# Vivado block design design_1, xc7z020clg484-1, Vivado 2018.3
# (continued, part 2 of 3)
current_bd_instance /link15

# ---- hierarchy /link16 ----
current_bd_instance /link16
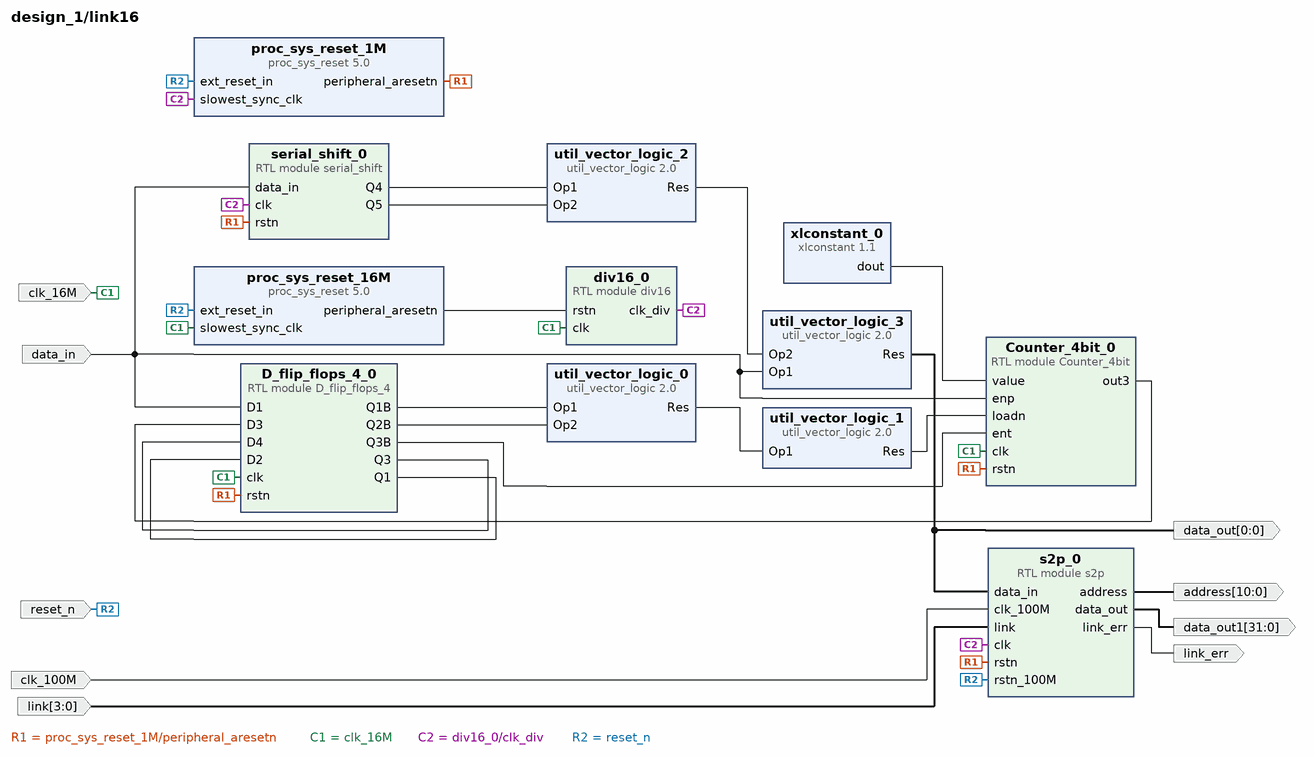
[diagram p14: block diagram inside /link16]
create_bd_pin -dir I clk_100M
create_bd_pin -dir I reset_n
create_bd_pin -dir I data_in
create_bd_pin -dir O -from 0 -to 0 data_out
create_bd_pin -dir I -from 3 -to 0 link
create_bd_pin -dir O link_err
create_bd_pin -dir O -from 10 -to 0 address
create_bd_pin -dir O -from 31 -to 0 data_out1
create_bd_pin -dir I clk_16M

create_bd_cell -type module -reference Counter_4bit Counter_4bit_0
create_bd_cell -type module -reference D_flip_flops_4 D_flip_flops_4_0
create_bd_cell -type module -reference div16 div16_0
create_bd_cell -type module -reference serial_shift serial_shift_0
create_bd_cell -type ip -vlnv xilinx.com:ip:xlconstant:1.1 xlconstant_0
set_property -dict {CONFIG.CONST_VAL 3 CONFIG.CONST_WIDTH 4} [get_bd_cells xlconstant_0]
create_bd_cell -type ip -vlnv xilinx.com:ip:util_vector_logic:2.0 util_vector_logic_0
set_property -dict {CONFIG.C_SIZE 1} [get_bd_cells util_vector_logic_0]
create_bd_cell -type ip -vlnv xilinx.com:ip:util_vector_logic:2.0 util_vector_logic_1
set_property -dict {CONFIG.C_OPERATION not CONFIG.C_SIZE 1} [get_bd_cells util_vector_logic_1]
create_bd_cell -type ip -vlnv xilinx.com:ip:util_vector_logic:2.0 util_vector_logic_2
set_property -dict {CONFIG.C_OPERATION xor CONFIG.C_SIZE 1} [get_bd_cells util_vector_logic_2]
create_bd_cell -type ip -vlnv xilinx.com:ip:util_vector_logic:2.0 util_vector_logic_3
set_property -dict {CONFIG.C_OPERATION xor CONFIG.C_SIZE 1} [get_bd_cells util_vector_logic_3]
create_bd_cell -type ip -vlnv xilinx.com:ip:proc_sys_reset:5.0 proc_sys_reset_16M
create_bd_cell -type ip -vlnv xilinx.com:ip:proc_sys_reset:5.0 proc_sys_reset_1M
create_bd_cell -type module -reference s2p s2p_0

# ---- hierarchy /link17 ----
current_bd_instance /link17
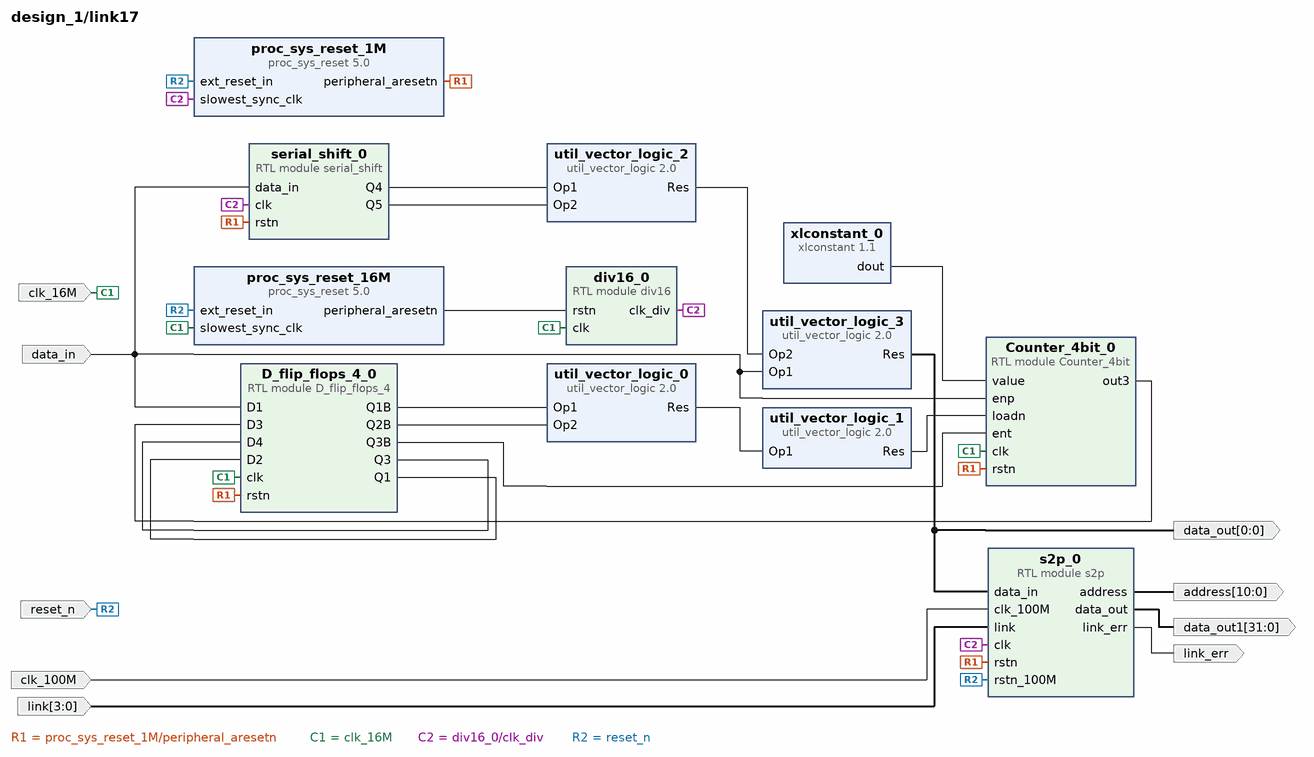
[diagram p15: block diagram inside /link17]
create_bd_pin -dir I clk_100M
create_bd_pin -dir I reset_n
create_bd_pin -dir I data_in
create_bd_pin -dir O -from 0 -to 0 data_out
create_bd_pin -dir I -from 3 -to 0 link
create_bd_pin -dir O link_err
create_bd_pin -dir O -from 10 -to 0 address
create_bd_pin -dir O -from 31 -to 0 data_out1
create_bd_pin -dir I clk_16M

create_bd_cell -type module -reference Counter_4bit Counter_4bit_0
create_bd_cell -type module -reference D_flip_flops_4 D_flip_flops_4_0
create_bd_cell -type module -reference div16 div16_0
create_bd_cell -type module -reference serial_shift serial_shift_0
create_bd_cell -type ip -vlnv xilinx.com:ip:xlconstant:1.1 xlconstant_0
set_property -dict {CONFIG.CONST_VAL 3 CONFIG.CONST_WIDTH 4} [get_bd_cells xlconstant_0]
create_bd_cell -type ip -vlnv xilinx.com:ip:util_vector_logic:2.0 util_vector_logic_0
set_property -dict {CONFIG.C_SIZE 1} [get_bd_cells util_vector_logic_0]
create_bd_cell -type ip -vlnv xilinx.com:ip:util_vector_logic:2.0 util_vector_logic_1
set_property -dict {CONFIG.C_OPERATION not CONFIG.C_SIZE 1} [get_bd_cells util_vector_logic_1]
create_bd_cell -type ip -vlnv xilinx.com:ip:util_vector_logic:2.0 util_vector_logic_2
set_property -dict {CONFIG.C_OPERATION xor CONFIG.C_SIZE 1} [get_bd_cells util_vector_logic_2]
create_bd_cell -type ip -vlnv xilinx.com:ip:util_vector_logic:2.0 util_vector_logic_3
set_property -dict {CONFIG.C_OPERATION xor CONFIG.C_SIZE 1} [get_bd_cells util_vector_logic_3]
create_bd_cell -type ip -vlnv xilinx.com:ip:proc_sys_reset:5.0 proc_sys_reset_16M
create_bd_cell -type ip -vlnv xilinx.com:ip:proc_sys_reset:5.0 proc_sys_reset_1M
create_bd_cell -type module -reference s2p s2p_0

# ---- hierarchy /link18 ----
current_bd_instance /link18
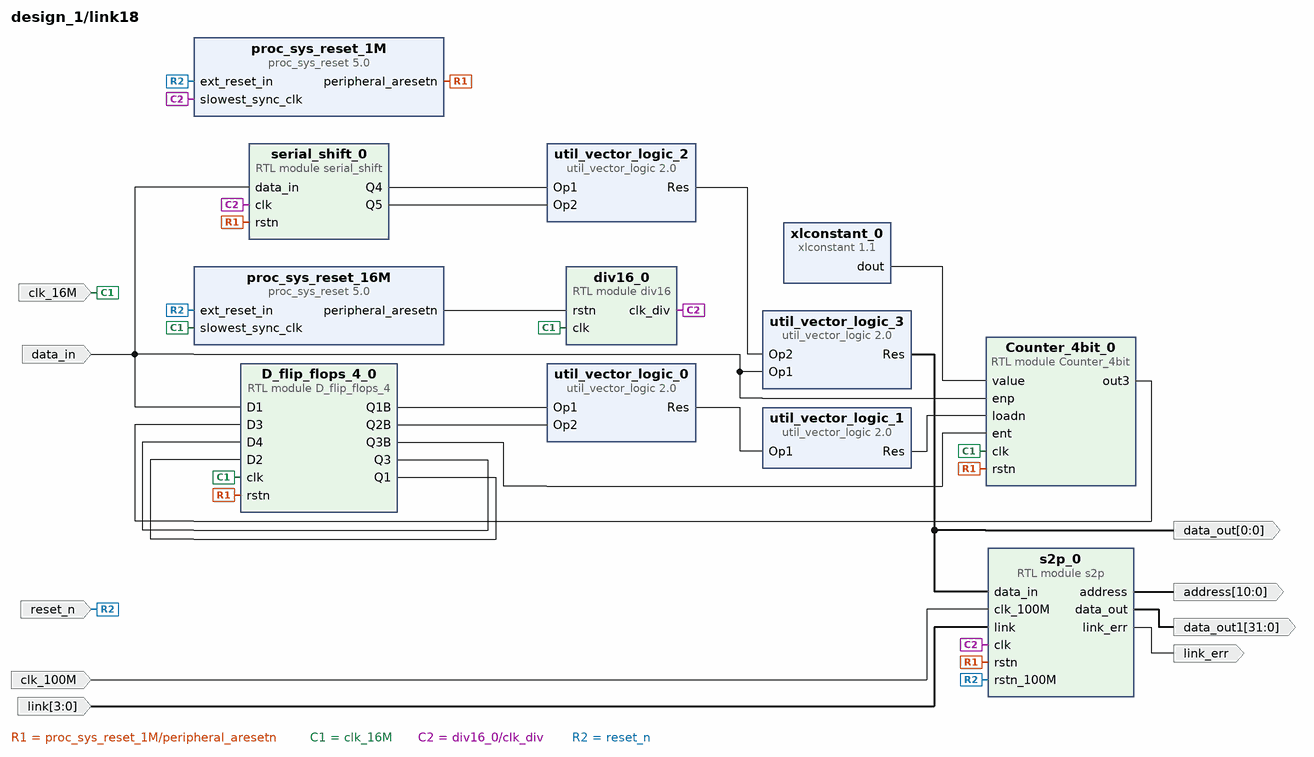
[diagram p16: block diagram inside /link18]
create_bd_pin -dir I clk_100M
create_bd_pin -dir I reset_n
create_bd_pin -dir I data_in
create_bd_pin -dir O -from 0 -to 0 data_out
create_bd_pin -dir I -from 3 -to 0 link
create_bd_pin -dir O link_err
create_bd_pin -dir O -from 10 -to 0 address
create_bd_pin -dir O -from 31 -to 0 data_out1
create_bd_pin -dir I clk_16M

create_bd_cell -type module -reference Counter_4bit Counter_4bit_0
create_bd_cell -type module -reference D_flip_flops_4 D_flip_flops_4_0
create_bd_cell -type module -reference div16 div16_0
create_bd_cell -type module -reference serial_shift serial_shift_0
create_bd_cell -type ip -vlnv xilinx.com:ip:xlconstant:1.1 xlconstant_0
set_property -dict {CONFIG.CONST_VAL 3 CONFIG.CONST_WIDTH 4} [get_bd_cells xlconstant_0]
create_bd_cell -type ip -vlnv xilinx.com:ip:util_vector_logic:2.0 util_vector_logic_0
set_property -dict {CONFIG.C_SIZE 1} [get_bd_cells util_vector_logic_0]
create_bd_cell -type ip -vlnv xilinx.com:ip:util_vector_logic:2.0 util_vector_logic_1
set_property -dict {CONFIG.C_OPERATION not CONFIG.C_SIZE 1} [get_bd_cells util_vector_logic_1]
create_bd_cell -type ip -vlnv xilinx.com:ip:util_vector_logic:2.0 util_vector_logic_2
set_property -dict {CONFIG.C_OPERATION xor CONFIG.C_SIZE 1} [get_bd_cells util_vector_logic_2]
create_bd_cell -type ip -vlnv xilinx.com:ip:util_vector_logic:2.0 util_vector_logic_3
set_property -dict {CONFIG.C_OPERATION xor CONFIG.C_SIZE 1} [get_bd_cells util_vector_logic_3]
create_bd_cell -type ip -vlnv xilinx.com:ip:proc_sys_reset:5.0 proc_sys_reset_16M
create_bd_cell -type ip -vlnv xilinx.com:ip:proc_sys_reset:5.0 proc_sys_reset_1M
create_bd_cell -type module -reference s2p s2p_0

# ---- hierarchy /link19 ----
current_bd_instance /link19
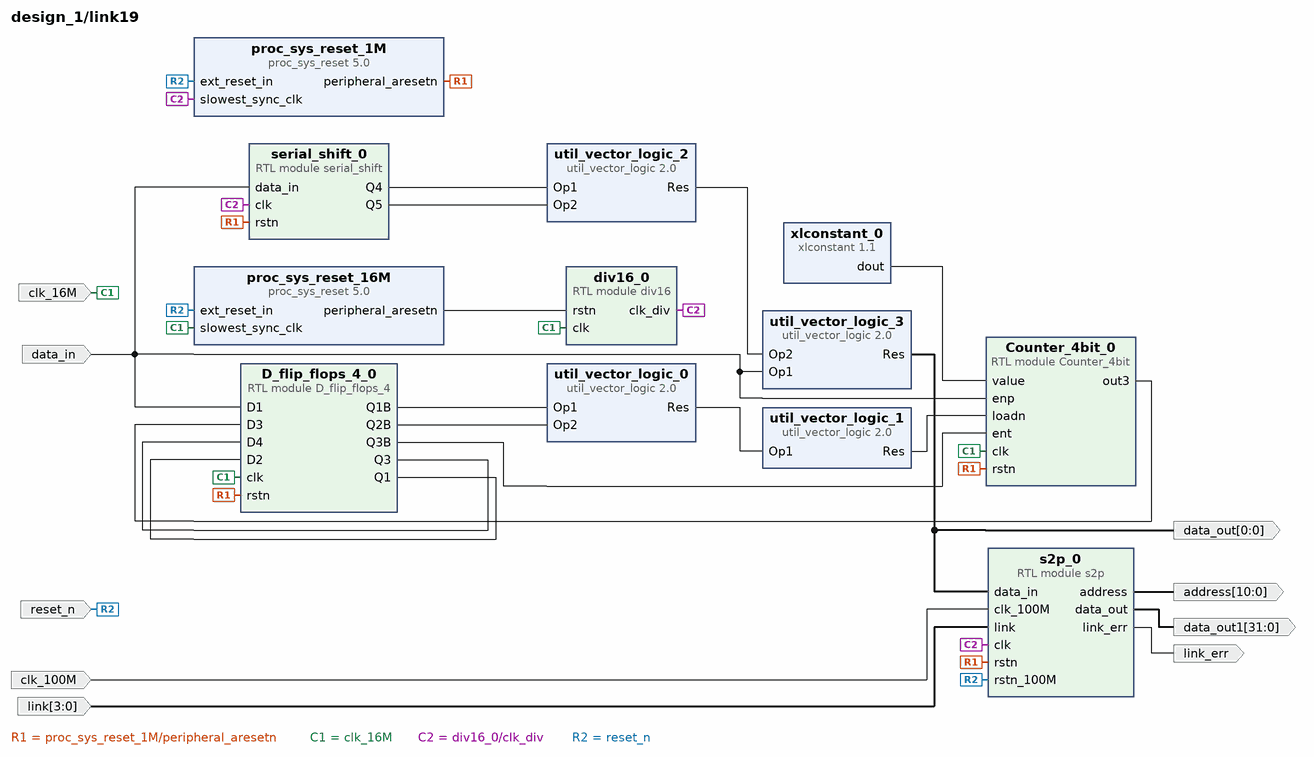
[diagram p17: block diagram inside /link19]
create_bd_pin -dir I clk_100M
create_bd_pin -dir I reset_n
create_bd_pin -dir I data_in
create_bd_pin -dir O -from 0 -to 0 data_out
create_bd_pin -dir I -from 3 -to 0 link
create_bd_pin -dir O link_err
create_bd_pin -dir O -from 10 -to 0 address
create_bd_pin -dir O -from 31 -to 0 data_out1
create_bd_pin -dir I clk_16M

create_bd_cell -type module -reference Counter_4bit Counter_4bit_0
create_bd_cell -type module -reference D_flip_flops_4 D_flip_flops_4_0
create_bd_cell -type module -reference div16 div16_0
create_bd_cell -type module -reference serial_shift serial_shift_0
create_bd_cell -type ip -vlnv xilinx.com:ip:xlconstant:1.1 xlconstant_0
set_property -dict {CONFIG.CONST_VAL 3 CONFIG.CONST_WIDTH 4} [get_bd_cells xlconstant_0]
create_bd_cell -type ip -vlnv xilinx.com:ip:util_vector_logic:2.0 util_vector_logic_0
set_property -dict {CONFIG.C_SIZE 1} [get_bd_cells util_vector_logic_0]
create_bd_cell -type ip -vlnv xilinx.com:ip:util_vector_logic:2.0 util_vector_logic_1
set_property -dict {CONFIG.C_OPERATION not CONFIG.C_SIZE 1} [get_bd_cells util_vector_logic_1]
create_bd_cell -type ip -vlnv xilinx.com:ip:util_vector_logic:2.0 util_vector_logic_2
set_property -dict {CONFIG.C_OPERATION xor CONFIG.C_SIZE 1} [get_bd_cells util_vector_logic_2]
create_bd_cell -type ip -vlnv xilinx.com:ip:util_vector_logic:2.0 util_vector_logic_3
set_property -dict {CONFIG.C_OPERATION xor CONFIG.C_SIZE 1} [get_bd_cells util_vector_logic_3]
create_bd_cell -type ip -vlnv xilinx.com:ip:proc_sys_reset:5.0 proc_sys_reset_16M
create_bd_cell -type ip -vlnv xilinx.com:ip:proc_sys_reset:5.0 proc_sys_reset_1M
create_bd_cell -type module -reference s2p s2p_0

# ---- hierarchy /link20 ----
current_bd_instance /link20
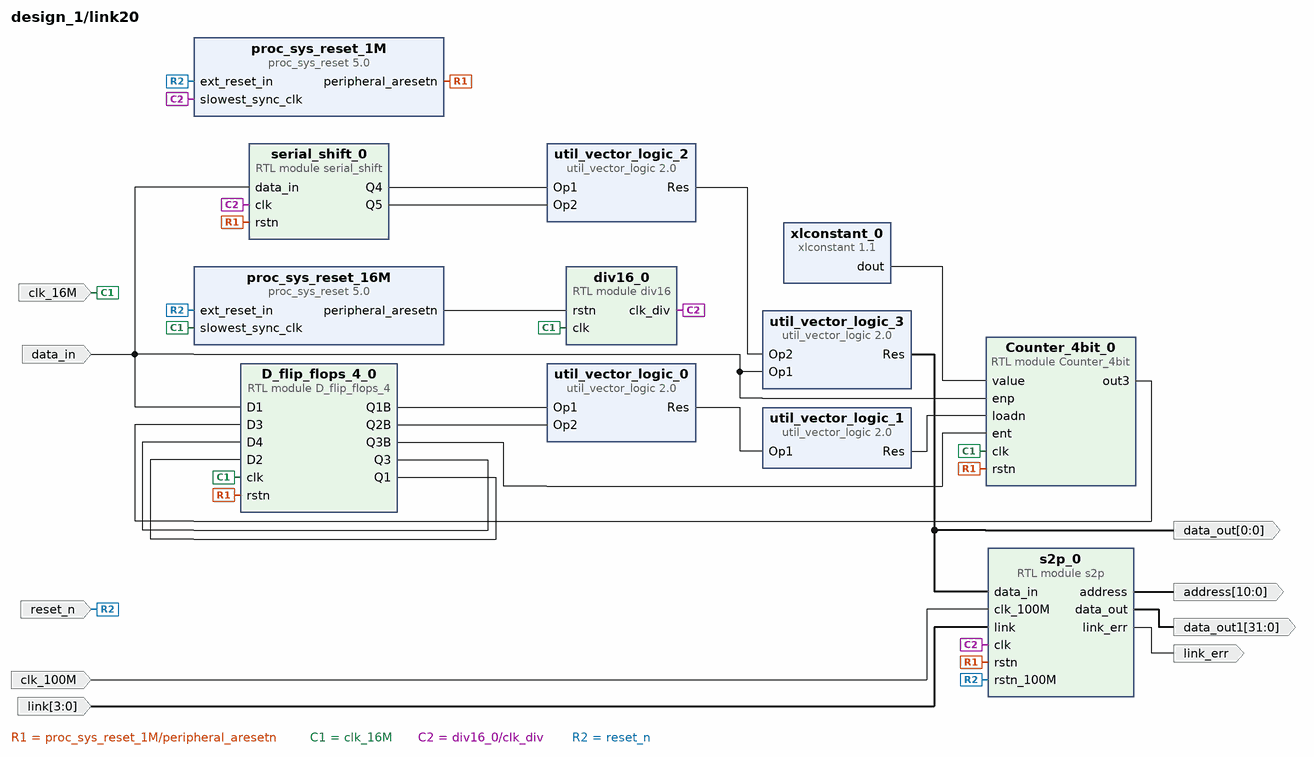
[diagram p18: block diagram inside /link20]
create_bd_pin -dir I clk_100M
create_bd_pin -dir I reset_n
create_bd_pin -dir I data_in
create_bd_pin -dir O -from 0 -to 0 data_out
create_bd_pin -dir I -from 3 -to 0 link
create_bd_pin -dir O link_err
create_bd_pin -dir O -from 10 -to 0 address
create_bd_pin -dir O -from 31 -to 0 data_out1
create_bd_pin -dir I clk_16M

create_bd_cell -type module -reference Counter_4bit Counter_4bit_0
create_bd_cell -type module -reference D_flip_flops_4 D_flip_flops_4_0
create_bd_cell -type module -reference div16 div16_0
create_bd_cell -type module -reference serial_shift serial_shift_0
create_bd_cell -type ip -vlnv xilinx.com:ip:xlconstant:1.1 xlconstant_0
set_property -dict {CONFIG.CONST_VAL 3 CONFIG.CONST_WIDTH 4} [get_bd_cells xlconstant_0]
create_bd_cell -type ip -vlnv xilinx.com:ip:util_vector_logic:2.0 util_vector_logic_0
set_property -dict {CONFIG.C_SIZE 1} [get_bd_cells util_vector_logic_0]
create_bd_cell -type ip -vlnv xilinx.com:ip:util_vector_logic:2.0 util_vector_logic_1
set_property -dict {CONFIG.C_OPERATION not CONFIG.C_SIZE 1} [get_bd_cells util_vector_logic_1]
create_bd_cell -type ip -vlnv xilinx.com:ip:util_vector_logic:2.0 util_vector_logic_2
set_property -dict {CONFIG.C_OPERATION xor CONFIG.C_SIZE 1} [get_bd_cells util_vector_logic_2]
create_bd_cell -type ip -vlnv xilinx.com:ip:util_vector_logic:2.0 util_vector_logic_3
set_property -dict {CONFIG.C_OPERATION xor CONFIG.C_SIZE 1} [get_bd_cells util_vector_logic_3]
create_bd_cell -type ip -vlnv xilinx.com:ip:proc_sys_reset:5.0 proc_sys_reset_16M
create_bd_cell -type ip -vlnv xilinx.com:ip:proc_sys_reset:5.0 proc_sys_reset_1M
create_bd_cell -type module -reference s2p s2p_0

# ---- hierarchy /link21 ----
current_bd_instance /link21
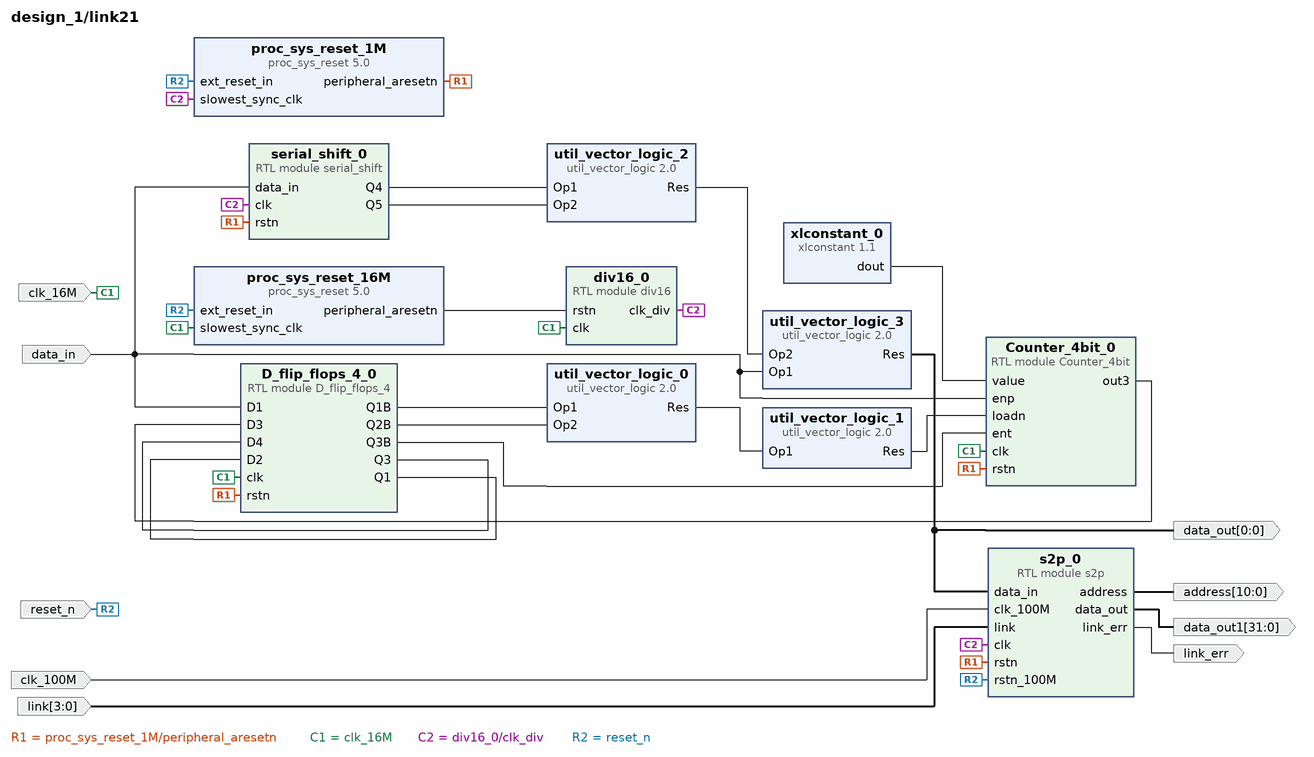
[diagram p19: block diagram inside /link21]
create_bd_pin -dir I clk_100M
create_bd_pin -dir I reset_n
create_bd_pin -dir I data_in
create_bd_pin -dir O -from 0 -to 0 data_out
create_bd_pin -dir I -from 3 -to 0 link
create_bd_pin -dir O link_err
create_bd_pin -dir O -from 10 -to 0 address
create_bd_pin -dir O -from 31 -to 0 data_out1
create_bd_pin -dir I clk_16M

create_bd_cell -type module -reference Counter_4bit Counter_4bit_0
create_bd_cell -type module -reference D_flip_flops_4 D_flip_flops_4_0
create_bd_cell -type module -reference div16 div16_0
create_bd_cell -type module -reference serial_shift serial_shift_0
create_bd_cell -type ip -vlnv xilinx.com:ip:xlconstant:1.1 xlconstant_0
set_property -dict {CONFIG.CONST_VAL 3 CONFIG.CONST_WIDTH 4} [get_bd_cells xlconstant_0]
create_bd_cell -type ip -vlnv xilinx.com:ip:util_vector_logic:2.0 util_vector_logic_0
set_property -dict {CONFIG.C_SIZE 1} [get_bd_cells util_vector_logic_0]
create_bd_cell -type ip -vlnv xilinx.com:ip:util_vector_logic:2.0 util_vector_logic_1
set_property -dict {CONFIG.C_OPERATION not CONFIG.C_SIZE 1} [get_bd_cells util_vector_logic_1]
create_bd_cell -type ip -vlnv xilinx.com:ip:util_vector_logic:2.0 util_vector_logic_2
set_property -dict {CONFIG.C_OPERATION xor CONFIG.C_SIZE 1} [get_bd_cells util_vector_logic_2]
create_bd_cell -type ip -vlnv xilinx.com:ip:util_vector_logic:2.0 util_vector_logic_3
set_property -dict {CONFIG.C_OPERATION xor CONFIG.C_SIZE 1} [get_bd_cells util_vector_logic_3]
create_bd_cell -type ip -vlnv xilinx.com:ip:proc_sys_reset:5.0 proc_sys_reset_16M
create_bd_cell -type ip -vlnv xilinx.com:ip:proc_sys_reset:5.0 proc_sys_reset_1M
create_bd_cell -type module -reference s2p s2p_0

# ---- hierarchy /link22 ----
current_bd_instance /link22
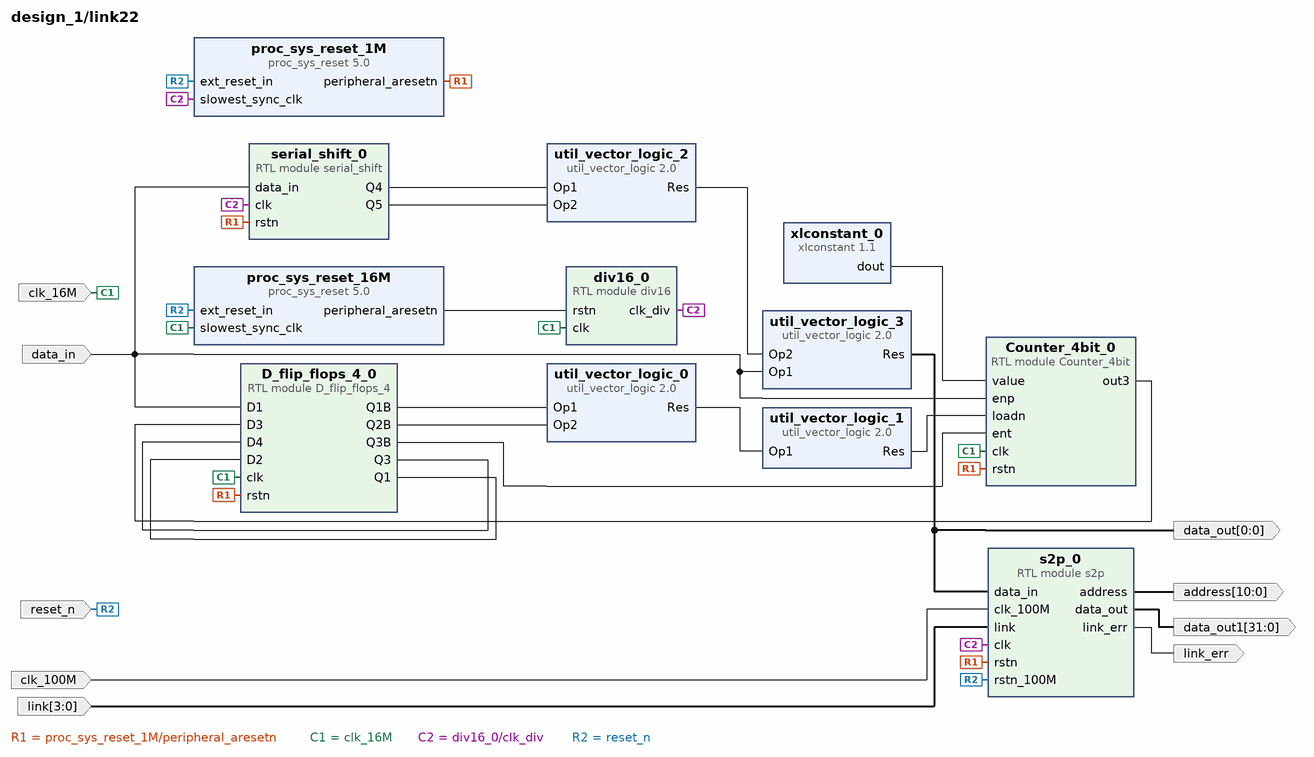
[diagram p20: block diagram inside /link22]
create_bd_pin -dir I clk_100M
create_bd_pin -dir I reset_n
create_bd_pin -dir I data_in
create_bd_pin -dir O -from 0 -to 0 data_out
create_bd_pin -dir I -from 3 -to 0 link
create_bd_pin -dir O link_err
create_bd_pin -dir O -from 10 -to 0 address
create_bd_pin -dir O -from 31 -to 0 data_out1
create_bd_pin -dir I clk_16M

create_bd_cell -type module -reference Counter_4bit Counter_4bit_0
create_bd_cell -type module -reference D_flip_flops_4 D_flip_flops_4_0
create_bd_cell -type module -reference div16 div16_0
create_bd_cell -type module -reference serial_shift serial_shift_0
create_bd_cell -type ip -vlnv xilinx.com:ip:xlconstant:1.1 xlconstant_0
set_property -dict {CONFIG.CONST_VAL 3 CONFIG.CONST_WIDTH 4} [get_bd_cells xlconstant_0]
create_bd_cell -type ip -vlnv xilinx.com:ip:util_vector_logic:2.0 util_vector_logic_0
set_property -dict {CONFIG.C_SIZE 1} [get_bd_cells util_vector_logic_0]
create_bd_cell -type ip -vlnv xilinx.com:ip:util_vector_logic:2.0 util_vector_logic_1
set_property -dict {CONFIG.C_OPERATION not CONFIG.C_SIZE 1} [get_bd_cells util_vector_logic_1]
create_bd_cell -type ip -vlnv xilinx.com:ip:util_vector_logic:2.0 util_vector_logic_2
set_property -dict {CONFIG.C_OPERATION xor CONFIG.C_SIZE 1} [get_bd_cells util_vector_logic_2]
create_bd_cell -type ip -vlnv xilinx.com:ip:util_vector_logic:2.0 util_vector_logic_3
set_property -dict {CONFIG.C_OPERATION xor CONFIG.C_SIZE 1} [get_bd_cells util_vector_logic_3]
create_bd_cell -type ip -vlnv xilinx.com:ip:proc_sys_reset:5.0 proc_sys_reset_16M
create_bd_cell -type ip -vlnv xilinx.com:ip:proc_sys_reset:5.0 proc_sys_reset_1M
create_bd_cell -type module -reference s2p s2p_0

# ---- connections ----

current_bd_instance /link7
connect_bd_net [get_bd_pins clk_100M] [get_bd_pins s2p_0/clk_100M]
connect_bd_net -net reset_n_1 [get_bd_pins proc_sys_reset_1M/peripheral_aresetn] \
  [get_bd_pins serial_shift_0/rstn] [get_bd_pins D_flip_flops_4_0/rstn] [get_bd_pins Counter_4bit_0/rstn] \
  [get_bd_pins s2p_0/rstn]
connect_bd_net -net clk_wiz_0_clk_out1 [get_bd_pins clk_16M] \
  [get_bd_pins div16_0/clk] [get_bd_pins Counter_4bit_0/clk] [get_bd_pins D_flip_flops_4_0/clk] \
  [get_bd_pins proc_sys_reset_16M/slowest_sync_clk]
connect_bd_net [get_bd_pins div16_0/clk_div] [get_bd_pins serial_shift_0/clk] [get_bd_pins proc_sys_reset_1M/slowest_sync_clk] [get_bd_pins s2p_0/clk]
connect_bd_net [get_bd_pins data_in] \
  [get_bd_pins serial_shift_0/data_in] [get_bd_pins D_flip_flops_4_0/D1] [get_bd_pins Counter_4bit_0/enp] \
  [get_bd_pins util_vector_logic_3/Op1]
connect_bd_net [get_bd_pins xlconstant_0/dout] [get_bd_pins Counter_4bit_0/value]
connect_bd_net [get_bd_pins D_flip_flops_4_0/Q3B] [get_bd_pins Counter_4bit_0/ent]
connect_bd_net [get_bd_pins D_flip_flops_4_0/Q1B] [get_bd_pins util_vector_logic_0/Op1]
connect_bd_net [get_bd_pins D_flip_flops_4_0/Q2B] [get_bd_pins util_vector_logic_0/Op2]
connect_bd_net [get_bd_pins util_vector_logic_0/Res] [get_bd_pins util_vector_logic_1/Op1]
connect_bd_net [get_bd_pins util_vector_logic_1/Res] [get_bd_pins Counter_4bit_0/loadn]
connect_bd_net [get_bd_pins Counter_4bit_0/out3] [get_bd_pins D_flip_flops_4_0/D3]
connect_bd_net [get_bd_pins D_flip_flops_4_0/Q3] [get_bd_pins D_flip_flops_4_0/D4]
connect_bd_net [get_bd_pins D_flip_flops_4_0/Q1] [get_bd_pins D_flip_flops_4_0/D2]
connect_bd_net [get_bd_pins serial_shift_0/Q4] [get_bd_pins util_vector_logic_2/Op1]
connect_bd_net [get_bd_pins serial_shift_0/Q5] [get_bd_pins util_vector_logic_2/Op2]
connect_bd_net [get_bd_pins util_vector_logic_2/Res] [get_bd_pins util_vector_logic_3/Op2]
connect_bd_net [get_bd_pins util_vector_logic_3/Res] [get_bd_pins data_out] [get_bd_pins s2p_0/data_in]
connect_bd_net [get_bd_pins reset_n] \
  [get_bd_pins proc_sys_reset_16M/ext_reset_in] [get_bd_pins proc_sys_reset_1M/ext_reset_in] [get_bd_pins s2p_0/rstn_100M]
connect_bd_net [get_bd_pins proc_sys_reset_16M/peripheral_aresetn] [get_bd_pins div16_0/rstn]
connect_bd_net [get_bd_pins link] [get_bd_pins s2p_0/link]
connect_bd_net [get_bd_pins s2p_0/link_err] [get_bd_pins link_err]
connect_bd_net [get_bd_pins s2p_0/address] [get_bd_pins address]
connect_bd_net [get_bd_pins s2p_0/data_out] [get_bd_pins data_out1]

current_bd_instance /link11
connect_bd_net [get_bd_pins clk_100M] [get_bd_pins s2p_0/clk_100M]
connect_bd_net -net reset_n_1 [get_bd_pins proc_sys_reset_1M/peripheral_aresetn] \
  [get_bd_pins serial_shift_0/rstn] [get_bd_pins D_flip_flops_4_0/rstn] [get_bd_pins Counter_4bit_0/rstn] \
  [get_bd_pins s2p_0/rstn]
connect_bd_net -net clk_wiz_0_clk_out1 [get_bd_pins clk_16M] \
  [get_bd_pins div16_0/clk] [get_bd_pins Counter_4bit_0/clk] [get_bd_pins D_flip_flops_4_0/clk] \
  [get_bd_pins proc_sys_reset_16M/slowest_sync_clk]
connect_bd_net [get_bd_pins div16_0/clk_div] [get_bd_pins serial_shift_0/clk] [get_bd_pins proc_sys_reset_1M/slowest_sync_clk] [get_bd_pins s2p_0/clk]
connect_bd_net [get_bd_pins data_in] \
  [get_bd_pins serial_shift_0/data_in] [get_bd_pins D_flip_flops_4_0/D1] [get_bd_pins Counter_4bit_0/enp] \
  [get_bd_pins util_vector_logic_3/Op1]
connect_bd_net [get_bd_pins xlconstant_0/dout] [get_bd_pins Counter_4bit_0/value]
connect_bd_net [get_bd_pins D_flip_flops_4_0/Q3B] [get_bd_pins Counter_4bit_0/ent]
connect_bd_net [get_bd_pins D_flip_flops_4_0/Q1B] [get_bd_pins util_vector_logic_0/Op1]
connect_bd_net [get_bd_pins D_flip_flops_4_0/Q2B] [get_bd_pins util_vector_logic_0/Op2]
connect_bd_net [get_bd_pins util_vector_logic_0/Res] [get_bd_pins util_vector_logic_1/Op1]
connect_bd_net [get_bd_pins util_vector_logic_1/Res] [get_bd_pins Counter_4bit_0/loadn]
connect_bd_net [get_bd_pins Counter_4bit_0/out3] [get_bd_pins D_flip_flops_4_0/D3]
connect_bd_net [get_bd_pins D_flip_flops_4_0/Q3] [get_bd_pins D_flip_flops_4_0/D4]
connect_bd_net [get_bd_pins D_flip_flops_4_0/Q1] [get_bd_pins D_flip_flops_4_0/D2]
connect_bd_net [get_bd_pins serial_shift_0/Q4] [get_bd_pins util_vector_logic_2/Op1]
connect_bd_net [get_bd_pins serial_shift_0/Q5] [get_bd_pins util_vector_logic_2/Op2]
connect_bd_net [get_bd_pins util_vector_logic_2/Res] [get_bd_pins util_vector_logic_3/Op2]
connect_bd_net [get_bd_pins util_vector_logic_3/Res] [get_bd_pins data_out] [get_bd_pins s2p_0/data_in]
connect_bd_net [get_bd_pins reset_n] \
  [get_bd_pins proc_sys_reset_16M/ext_reset_in] [get_bd_pins proc_sys_reset_1M/ext_reset_in] [get_bd_pins s2p_0/rstn_100M]
connect_bd_net [get_bd_pins proc_sys_reset_16M/peripheral_aresetn] [get_bd_pins div16_0/rstn]
connect_bd_net [get_bd_pins link] [get_bd_pins s2p_0/link]
connect_bd_net [get_bd_pins s2p_0/link_err] [get_bd_pins link_err]
connect_bd_net [get_bd_pins s2p_0/address] [get_bd_pins address]
connect_bd_net [get_bd_pins s2p_0/data_out] [get_bd_pins data_out1]

current_bd_instance /link8
connect_bd_net [get_bd_pins clk_100M] [get_bd_pins s2p_0/clk_100M]
connect_bd_net -net reset_n_1 [get_bd_pins proc_sys_reset_1M/peripheral_aresetn] \
  [get_bd_pins serial_shift_0/rstn] [get_bd_pins D_flip_flops_4_0/rstn] [get_bd_pins Counter_4bit_0/rstn] \
  [get_bd_pins s2p_0/rstn]
connect_bd_net -net clk_wiz_0_clk_out1 [get_bd_pins clk_16M] \
  [get_bd_pins div16_0/clk] [get_bd_pins Counter_4bit_0/clk] [get_bd_pins D_flip_flops_4_0/clk] \
  [get_bd_pins proc_sys_reset_16M/slowest_sync_clk]
connect_bd_net [get_bd_pins div16_0/clk_div] [get_bd_pins serial_shift_0/clk] [get_bd_pins proc_sys_reset_1M/slowest_sync_clk] [get_bd_pins s2p_0/clk]
connect_bd_net [get_bd_pins data_in] \
  [get_bd_pins serial_shift_0/data_in] [get_bd_pins D_flip_flops_4_0/D1] [get_bd_pins Counter_4bit_0/enp] \
  [get_bd_pins util_vector_logic_3/Op1]
connect_bd_net [get_bd_pins xlconstant_0/dout] [get_bd_pins Counter_4bit_0/value]
connect_bd_net [get_bd_pins D_flip_flops_4_0/Q3B] [get_bd_pins Counter_4bit_0/ent]
connect_bd_net [get_bd_pins D_flip_flops_4_0/Q1B] [get_bd_pins util_vector_logic_0/Op1]
connect_bd_net [get_bd_pins D_flip_flops_4_0/Q2B] [get_bd_pins util_vector_logic_0/Op2]
connect_bd_net [get_bd_pins util_vector_logic_0/Res] [get_bd_pins util_vector_logic_1/Op1]
connect_bd_net [get_bd_pins util_vector_logic_1/Res] [get_bd_pins Counter_4bit_0/loadn]
connect_bd_net [get_bd_pins Counter_4bit_0/out3] [get_bd_pins D_flip_flops_4_0/D3]
connect_bd_net [get_bd_pins D_flip_flops_4_0/Q3] [get_bd_pins D_flip_flops_4_0/D4]
connect_bd_net [get_bd_pins D_flip_flops_4_0/Q1] [get_bd_pins D_flip_flops_4_0/D2]
connect_bd_net [get_bd_pins serial_shift_0/Q4] [get_bd_pins util_vector_logic_2/Op1]
connect_bd_net [get_bd_pins serial_shift_0/Q5] [get_bd_pins util_vector_logic_2/Op2]
connect_bd_net [get_bd_pins util_vector_logic_2/Res] [get_bd_pins util_vector_logic_3/Op2]
connect_bd_net [get_bd_pins util_vector_logic_3/Res] [get_bd_pins data_out] [get_bd_pins s2p_0/data_in]
connect_bd_net [get_bd_pins reset_n] \
  [get_bd_pins proc_sys_reset_16M/ext_reset_in] [get_bd_pins proc_sys_reset_1M/ext_reset_in] [get_bd_pins s2p_0/rstn_100M]
connect_bd_net [get_bd_pins proc_sys_reset_16M/peripheral_aresetn] [get_bd_pins div16_0/rstn]
connect_bd_net [get_bd_pins link] [get_bd_pins s2p_0/link]
connect_bd_net [get_bd_pins s2p_0/link_err] [get_bd_pins link_err]
connect_bd_net [get_bd_pins s2p_0/address] [get_bd_pins address]
connect_bd_net [get_bd_pins s2p_0/data_out] [get_bd_pins data_out1]

current_bd_instance /link9
connect_bd_net [get_bd_pins clk_100M] [get_bd_pins s2p_0/clk_100M]
connect_bd_net -net reset_n_1 [get_bd_pins proc_sys_reset_1M/peripheral_aresetn] \
  [get_bd_pins serial_shift_0/rstn] [get_bd_pins D_flip_flops_4_0/rstn] [get_bd_pins Counter_4bit_0/rstn] \
  [get_bd_pins s2p_0/rstn]
connect_bd_net -net clk_wiz_0_clk_out1 [get_bd_pins clk_16M] \
  [get_bd_pins div16_0/clk] [get_bd_pins Counter_4bit_0/clk] [get_bd_pins D_flip_flops_4_0/clk] \
  [get_bd_pins proc_sys_reset_16M/slowest_sync_clk]
connect_bd_net [get_bd_pins div16_0/clk_div] [get_bd_pins serial_shift_0/clk] [get_bd_pins proc_sys_reset_1M/slowest_sync_clk] [get_bd_pins s2p_0/clk]
connect_bd_net [get_bd_pins data_in] \
  [get_bd_pins serial_shift_0/data_in] [get_bd_pins D_flip_flops_4_0/D1] [get_bd_pins Counter_4bit_0/enp] \
  [get_bd_pins util_vector_logic_3/Op1]
connect_bd_net [get_bd_pins xlconstant_0/dout] [get_bd_pins Counter_4bit_0/value]
connect_bd_net [get_bd_pins D_flip_flops_4_0/Q3B] [get_bd_pins Counter_4bit_0/ent]
connect_bd_net [get_bd_pins D_flip_flops_4_0/Q1B] [get_bd_pins util_vector_logic_0/Op1]
connect_bd_net [get_bd_pins D_flip_flops_4_0/Q2B] [get_bd_pins util_vector_logic_0/Op2]
connect_bd_net [get_bd_pins util_vector_logic_0/Res] [get_bd_pins util_vector_logic_1/Op1]
connect_bd_net [get_bd_pins util_vector_logic_1/Res] [get_bd_pins Counter_4bit_0/loadn]
connect_bd_net [get_bd_pins Counter_4bit_0/out3] [get_bd_pins D_flip_flops_4_0/D3]
connect_bd_net [get_bd_pins D_flip_flops_4_0/Q3] [get_bd_pins D_flip_flops_4_0/D4]
connect_bd_net [get_bd_pins D_flip_flops_4_0/Q1] [get_bd_pins D_flip_flops_4_0/D2]
connect_bd_net [get_bd_pins serial_shift_0/Q4] [get_bd_pins util_vector_logic_2/Op1]
connect_bd_net [get_bd_pins serial_shift_0/Q5] [get_bd_pins util_vector_logic_2/Op2]
connect_bd_net [get_bd_pins util_vector_logic_2/Res] [get_bd_pins util_vector_logic_3/Op2]
connect_bd_net [get_bd_pins util_vector_logic_3/Res] [get_bd_pins data_out] [get_bd_pins s2p_0/data_in]
connect_bd_net [get_bd_pins reset_n] \
  [get_bd_pins proc_sys_reset_16M/ext_reset_in] [get_bd_pins proc_sys_reset_1M/ext_reset_in] [get_bd_pins s2p_0/rstn_100M]
connect_bd_net [get_bd_pins proc_sys_reset_16M/peripheral_aresetn] [get_bd_pins div16_0/rstn]
connect_bd_net [get_bd_pins link] [get_bd_pins s2p_0/link]
connect_bd_net [get_bd_pins s2p_0/link_err] [get_bd_pins link_err]
connect_bd_net [get_bd_pins s2p_0/address] [get_bd_pins address]
connect_bd_net [get_bd_pins s2p_0/data_out] [get_bd_pins data_out1]

current_bd_instance /link10
connect_bd_net [get_bd_pins clk_100M] [get_bd_pins s2p_0/clk_100M]
connect_bd_net -net reset_n_1 [get_bd_pins proc_sys_reset_1M/peripheral_aresetn] \
  [get_bd_pins serial_shift_0/rstn] [get_bd_pins D_flip_flops_4_0/rstn] [get_bd_pins Counter_4bit_0/rstn] \
  [get_bd_pins s2p_0/rstn]
connect_bd_net -net clk_wiz_0_clk_out1 [get_bd_pins clk_16M] \
  [get_bd_pins div16_0/clk] [get_bd_pins Counter_4bit_0/clk] [get_bd_pins D_flip_flops_4_0/clk] \
  [get_bd_pins proc_sys_reset_16M/slowest_sync_clk]
connect_bd_net [get_bd_pins div16_0/clk_div] [get_bd_pins serial_shift_0/clk] [get_bd_pins proc_sys_reset_1M/slowest_sync_clk] [get_bd_pins s2p_0/clk]
connect_bd_net [get_bd_pins data_in] \
  [get_bd_pins serial_shift_0/data_in] [get_bd_pins D_flip_flops_4_0/D1] [get_bd_pins Counter_4bit_0/enp] \
  [get_bd_pins util_vector_logic_3/Op1]
connect_bd_net [get_bd_pins xlconstant_0/dout] [get_bd_pins Counter_4bit_0/value]
connect_bd_net [get_bd_pins D_flip_flops_4_0/Q3B] [get_bd_pins Counter_4bit_0/ent]
connect_bd_net [get_bd_pins D_flip_flops_4_0/Q1B] [get_bd_pins util_vector_logic_0/Op1]
connect_bd_net [get_bd_pins D_flip_flops_4_0/Q2B] [get_bd_pins util_vector_logic_0/Op2]
connect_bd_net [get_bd_pins util_vector_logic_0/Res] [get_bd_pins util_vector_logic_1/Op1]
connect_bd_net [get_bd_pins util_vector_logic_1/Res] [get_bd_pins Counter_4bit_0/loadn]
connect_bd_net [get_bd_pins Counter_4bit_0/out3] [get_bd_pins D_flip_flops_4_0/D3]
connect_bd_net [get_bd_pins D_flip_flops_4_0/Q3] [get_bd_pins D_flip_flops_4_0/D4]
connect_bd_net [get_bd_pins D_flip_flops_4_0/Q1] [get_bd_pins D_flip_flops_4_0/D2]
connect_bd_net [get_bd_pins serial_shift_0/Q4] [get_bd_pins util_vector_logic_2/Op1]
connect_bd_net [get_bd_pins serial_shift_0/Q5] [get_bd_pins util_vector_logic_2/Op2]
connect_bd_net [get_bd_pins util_vector_logic_2/Res] [get_bd_pins util_vector_logic_3/Op2]
connect_bd_net [get_bd_pins util_vector_logic_3/Res] [get_bd_pins data_out] [get_bd_pins s2p_0/data_in]
connect_bd_net [get_bd_pins reset_n] \
  [get_bd_pins proc_sys_reset_16M/ext_reset_in] [get_bd_pins proc_sys_reset_1M/ext_reset_in] [get_bd_pins s2p_0/rstn_100M]
connect_bd_net [get_bd_pins proc_sys_reset_16M/peripheral_aresetn] [get_bd_pins div16_0/rstn]
connect_bd_net [get_bd_pins link] [get_bd_pins s2p_0/link]
connect_bd_net [get_bd_pins s2p_0/link_err] [get_bd_pins link_err]
connect_bd_net [get_bd_pins s2p_0/address] [get_bd_pins address]
connect_bd_net [get_bd_pins s2p_0/data_out] [get_bd_pins data_out1]

current_bd_instance /link12
connect_bd_net [get_bd_pins clk_100M] [get_bd_pins s2p_0/clk_100M]
connect_bd_net -net reset_n_1 [get_bd_pins proc_sys_reset_1M/peripheral_aresetn] \
  [get_bd_pins serial_shift_0/rstn] [get_bd_pins D_flip_flops_4_0/rstn] [get_bd_pins Counter_4bit_0/rstn] \
  [get_bd_pins s2p_0/rstn]
connect_bd_net -net clk_wiz_0_clk_out1 [get_bd_pins clk_16M] \
  [get_bd_pins div16_0/clk] [get_bd_pins Counter_4bit_0/clk] [get_bd_pins D_flip_flops_4_0/clk] \
  [get_bd_pins proc_sys_reset_16M/slowest_sync_clk]
connect_bd_net [get_bd_pins div16_0/clk_div] [get_bd_pins serial_shift_0/clk] [get_bd_pins proc_sys_reset_1M/slowest_sync_clk] [get_bd_pins s2p_0/clk]
connect_bd_net [get_bd_pins data_in] \
  [get_bd_pins serial_shift_0/data_in] [get_bd_pins D_flip_flops_4_0/D1] [get_bd_pins Counter_4bit_0/enp] \
  [get_bd_pins util_vector_logic_3/Op1]
connect_bd_net [get_bd_pins xlconstant_0/dout] [get_bd_pins Counter_4bit_0/value]
connect_bd_net [get_bd_pins D_flip_flops_4_0/Q3B] [get_bd_pins Counter_4bit_0/ent]
connect_bd_net [get_bd_pins D_flip_flops_4_0/Q1B] [get_bd_pins util_vector_logic_0/Op1]
connect_bd_net [get_bd_pins D_flip_flops_4_0/Q2B] [get_bd_pins util_vector_logic_0/Op2]
connect_bd_net [get_bd_pins util_vector_logic_0/Res] [get_bd_pins util_vector_logic_1/Op1]
connect_bd_net [get_bd_pins util_vector_logic_1/Res] [get_bd_pins Counter_4bit_0/loadn]
connect_bd_net [get_bd_pins Counter_4bit_0/out3] [get_bd_pins D_flip_flops_4_0/D3]
connect_bd_net [get_bd_pins D_flip_flops_4_0/Q3] [get_bd_pins D_flip_flops_4_0/D4]
connect_bd_net [get_bd_pins D_flip_flops_4_0/Q1] [get_bd_pins D_flip_flops_4_0/D2]
connect_bd_net [get_bd_pins serial_shift_0/Q4] [get_bd_pins util_vector_logic_2/Op1]
connect_bd_net [get_bd_pins serial_shift_0/Q5] [get_bd_pins util_vector_logic_2/Op2]
connect_bd_net [get_bd_pins util_vector_logic_2/Res] [get_bd_pins util_vector_logic_3/Op2]
connect_bd_net [get_bd_pins util_vector_logic_3/Res] [get_bd_pins data_out] [get_bd_pins s2p_0/data_in]
connect_bd_net [get_bd_pins reset_n] \
  [get_bd_pins proc_sys_reset_16M/ext_reset_in] [get_bd_pins proc_sys_reset_1M/ext_reset_in] [get_bd_pins s2p_0/rstn_100M]
connect_bd_net [get_bd_pins proc_sys_reset_16M/peripheral_aresetn] [get_bd_pins div16_0/rstn]
connect_bd_net [get_bd_pins link] [get_bd_pins s2p_0/link]
connect_bd_net [get_bd_pins s2p_0/link_err] [get_bd_pins link_err]
connect_bd_net [get_bd_pins s2p_0/address] [get_bd_pins address]
connect_bd_net [get_bd_pins s2p_0/data_out] [get_bd_pins data_out1]

current_bd_instance /link13
connect_bd_net [get_bd_pins clk_100M] [get_bd_pins s2p_0/clk_100M]
connect_bd_net -net reset_n_1 [get_bd_pins proc_sys_reset_1M/peripheral_aresetn] \
  [get_bd_pins serial_shift_0/rstn] [get_bd_pins D_flip_flops_4_0/rstn] [get_bd_pins Counter_4bit_0/rstn] \
  [get_bd_pins s2p_0/rstn]
connect_bd_net -net clk_wiz_0_clk_out1 [get_bd_pins clk_16M] \
  [get_bd_pins div16_0/clk] [get_bd_pins Counter_4bit_0/clk] [get_bd_pins D_flip_flops_4_0/clk] \
  [get_bd_pins proc_sys_reset_16M/slowest_sync_clk]
connect_bd_net [get_bd_pins div16_0/clk_div] [get_bd_pins serial_shift_0/clk] [get_bd_pins proc_sys_reset_1M/slowest_sync_clk] [get_bd_pins s2p_0/clk]
connect_bd_net [get_bd_pins data_in] \
  [get_bd_pins serial_shift_0/data_in] [get_bd_pins D_flip_flops_4_0/D1] [get_bd_pins Counter_4bit_0/enp] \
  [get_bd_pins util_vector_logic_3/Op1]
connect_bd_net [get_bd_pins xlconstant_0/dout] [get_bd_pins Counter_4bit_0/value]
connect_bd_net [get_bd_pins D_flip_flops_4_0/Q3B] [get_bd_pins Counter_4bit_0/ent]
connect_bd_net [get_bd_pins D_flip_flops_4_0/Q1B] [get_bd_pins util_vector_logic_0/Op1]
connect_bd_net [get_bd_pins D_flip_flops_4_0/Q2B] [get_bd_pins util_vector_logic_0/Op2]
connect_bd_net [get_bd_pins util_vector_logic_0/Res] [get_bd_pins util_vector_logic_1/Op1]
connect_bd_net [get_bd_pins util_vector_logic_1/Res] [get_bd_pins Counter_4bit_0/loadn]
connect_bd_net [get_bd_pins Counter_4bit_0/out3] [get_bd_pins D_flip_flops_4_0/D3]
connect_bd_net [get_bd_pins D_flip_flops_4_0/Q3] [get_bd_pins D_flip_flops_4_0/D4]
connect_bd_net [get_bd_pins D_flip_flops_4_0/Q1] [get_bd_pins D_flip_flops_4_0/D2]
connect_bd_net [get_bd_pins serial_shift_0/Q4] [get_bd_pins util_vector_logic_2/Op1]
connect_bd_net [get_bd_pins serial_shift_0/Q5] [get_bd_pins util_vector_logic_2/Op2]
connect_bd_net [get_bd_pins util_vector_logic_2/Res] [get_bd_pins util_vector_logic_3/Op2]
connect_bd_net [get_bd_pins util_vector_logic_3/Res] [get_bd_pins data_out] [get_bd_pins s2p_0/data_in]
connect_bd_net [get_bd_pins reset_n] \
  [get_bd_pins proc_sys_reset_16M/ext_reset_in] [get_bd_pins proc_sys_reset_1M/ext_reset_in] [get_bd_pins s2p_0/rstn_100M]
connect_bd_net [get_bd_pins proc_sys_reset_16M/peripheral_aresetn] [get_bd_pins div16_0/rstn]
connect_bd_net [get_bd_pins link] [get_bd_pins s2p_0/link]
connect_bd_net [get_bd_pins s2p_0/link_err] [get_bd_pins link_err]
connect_bd_net [get_bd_pins s2p_0/address] [get_bd_pins address]
connect_bd_net [get_bd_pins s2p_0/data_out] [get_bd_pins data_out1]

current_bd_instance /link14
connect_bd_net [get_bd_pins clk_100M] [get_bd_pins s2p_0/clk_100M]
connect_bd_net -net reset_n_1 [get_bd_pins proc_sys_reset_1M/peripheral_aresetn] \
  [get_bd_pins serial_shift_0/rstn] [get_bd_pins D_flip_flops_4_0/rstn] [get_bd_pins Counter_4bit_0/rstn] \
  [get_bd_pins s2p_0/rstn]
connect_bd_net -net clk_wiz_0_clk_out1 [get_bd_pins clk_16M] \
  [get_bd_pins div16_0/clk] [get_bd_pins Counter_4bit_0/clk] [get_bd_pins D_flip_flops_4_0/clk] \
  [get_bd_pins proc_sys_reset_16M/slowest_sync_clk]
connect_bd_net [get_bd_pins div16_0/clk_div] [get_bd_pins serial_shift_0/clk] [get_bd_pins proc_sys_reset_1M/slowest_sync_clk] [get_bd_pins s2p_0/clk]
connect_bd_net [get_bd_pins data_in] \
  [get_bd_pins serial_shift_0/data_in] [get_bd_pins D_flip_flops_4_0/D1] [get_bd_pins Counter_4bit_0/enp] \
  [get_bd_pins util_vector_logic_3/Op1]
connect_bd_net [get_bd_pins xlconstant_0/dout] [get_bd_pins Counter_4bit_0/value]
connect_bd_net [get_bd_pins D_flip_flops_4_0/Q3B] [get_bd_pins Counter_4bit_0/ent]
connect_bd_net [get_bd_pins D_flip_flops_4_0/Q1B] [get_bd_pins util_vector_logic_0/Op1]
connect_bd_net [get_bd_pins D_flip_flops_4_0/Q2B] [get_bd_pins util_vector_logic_0/Op2]
connect_bd_net [get_bd_pins util_vector_logic_0/Res] [get_bd_pins util_vector_logic_1/Op1]
connect_bd_net [get_bd_pins util_vector_logic_1/Res] [get_bd_pins Counter_4bit_0/loadn]
connect_bd_net [get_bd_pins Counter_4bit_0/out3] [get_bd_pins D_flip_flops_4_0/D3]
connect_bd_net [get_bd_pins D_flip_flops_4_0/Q3] [get_bd_pins D_flip_flops_4_0/D4]
connect_bd_net [get_bd_pins D_flip_flops_4_0/Q1] [get_bd_pins D_flip_flops_4_0/D2]
connect_bd_net [get_bd_pins serial_shift_0/Q4] [get_bd_pins util_vector_logic_2/Op1]
connect_bd_net [get_bd_pins serial_shift_0/Q5] [get_bd_pins util_vector_logic_2/Op2]
connect_bd_net [get_bd_pins util_vector_logic_2/Res] [get_bd_pins util_vector_logic_3/Op2]
connect_bd_net [get_bd_pins util_vector_logic_3/Res] [get_bd_pins data_out] [get_bd_pins s2p_0/data_in]
connect_bd_net [get_bd_pins reset_n] \
  [get_bd_pins proc_sys_reset_16M/ext_reset_in] [get_bd_pins proc_sys_reset_1M/ext_reset_in] [get_bd_pins s2p_0/rstn_100M]
connect_bd_net [get_bd_pins proc_sys_reset_16M/peripheral_aresetn] [get_bd_pins div16_0/rstn]
connect_bd_net [get_bd_pins link] [get_bd_pins s2p_0/link]
connect_bd_net [get_bd_pins s2p_0/link_err] [get_bd_pins link_err]
connect_bd_net [get_bd_pins s2p_0/data_out] [get_bd_pins data_out1]
connect_bd_net [get_bd_pins s2p_0/address] [get_bd_pins address]

current_bd_instance /link15
connect_bd_net [get_bd_pins clk_100M] [get_bd_pins s2p_0/clk_100M]
connect_bd_net -net reset_n_1 [get_bd_pins proc_sys_reset_1M/peripheral_aresetn] \
  [get_bd_pins serial_shift_0/rstn] [get_bd_pins D_flip_flops_4_0/rstn] [get_bd_pins Counter_4bit_0/rstn] \
  [get_bd_pins s2p_0/rstn]
connect_bd_net -net clk_wiz_0_clk_out1 [get_bd_pins clk_16M] \
  [get_bd_pins div16_0/clk] [get_bd_pins Counter_4bit_0/clk] [get_bd_pins D_flip_flops_4_0/clk] \
  [get_bd_pins proc_sys_reset_16M/slowest_sync_clk]
connect_bd_net [get_bd_pins div16_0/clk_div] [get_bd_pins serial_shift_0/clk] [get_bd_pins proc_sys_reset_1M/slowest_sync_clk] [get_bd_pins s2p_0/clk]
connect_bd_net [get_bd_pins data_in] \
  [get_bd_pins serial_shift_0/data_in] [get_bd_pins D_flip_flops_4_0/D1] [get_bd_pins Counter_4bit_0/enp] \
  [get_bd_pins util_vector_logic_3/Op1]
connect_bd_net [get_bd_pins xlconstant_0/dout] [get_bd_pins Counter_4bit_0/value]
connect_bd_net [get_bd_pins D_flip_flops_4_0/Q3B] [get_bd_pins Counter_4bit_0/ent]
connect_bd_net [get_bd_pins D_flip_flops_4_0/Q1B] [get_bd_pins util_vector_logic_0/Op1]
connect_bd_net [get_bd_pins D_flip_flops_4_0/Q2B] [get_bd_pins util_vector_logic_0/Op2]
connect_bd_net [get_bd_pins util_vector_logic_0/Res] [get_bd_pins util_vector_logic_1/Op1]
connect_bd_net [get_bd_pins util_vector_logic_1/Res] [get_bd_pins Counter_4bit_0/loadn]
connect_bd_net [get_bd_pins Counter_4bit_0/out3] [get_bd_pins D_flip_flops_4_0/D3]
connect_bd_net [get_bd_pins D_flip_flops_4_0/Q3] [get_bd_pins D_flip_flops_4_0/D4]
connect_bd_net [get_bd_pins D_flip_flops_4_0/Q1] [get_bd_pins D_flip_flops_4_0/D2]
connect_bd_net [get_bd_pins serial_shift_0/Q4] [get_bd_pins util_vector_logic_2/Op1]
connect_bd_net [get_bd_pins serial_shift_0/Q5] [get_bd_pins util_vector_logic_2/Op2]
connect_bd_net [get_bd_pins util_vector_logic_2/Res] [get_bd_pins util_vector_logic_3/Op2]
connect_bd_net [get_bd_pins util_vector_logic_3/Res] [get_bd_pins data_out] [get_bd_pins s2p_0/data_in]
connect_bd_net [get_bd_pins reset_n] \
  [get_bd_pins proc_sys_reset_16M/ext_reset_in] [get_bd_pins proc_sys_reset_1M/ext_reset_in] [get_bd_pins s2p_0/rstn_100M]
connect_bd_net [get_bd_pins proc_sys_reset_16M/peripheral_aresetn] [get_bd_pins div16_0/rstn]
connect_bd_net [get_bd_pins link] [get_bd_pins s2p_0/link]
connect_bd_net [get_bd_pins s2p_0/link_err] [get_bd_pins link_err]
connect_bd_net [get_bd_pins s2p_0/address] [get_bd_pins address]
connect_bd_net [get_bd_pins s2p_0/data_out] [get_bd_pins data_out1]

current_bd_instance /link16
connect_bd_net [get_bd_pins clk_100M] [get_bd_pins s2p_0/clk_100M]
connect_bd_net -net reset_n_1 [get_bd_pins proc_sys_reset_1M/peripheral_aresetn] \
  [get_bd_pins serial_shift_0/rstn] [get_bd_pins D_flip_flops_4_0/rstn] [get_bd_pins Counter_4bit_0/rstn] \
  [get_bd_pins s2p_0/rstn]
connect_bd_net -net clk_wiz_0_clk_out1 [get_bd_pins clk_16M] \
  [get_bd_pins div16_0/clk] [get_bd_pins Counter_4bit_0/clk] [get_bd_pins D_flip_flops_4_0/clk] \
  [get_bd_pins proc_sys_reset_16M/slowest_sync_clk]
connect_bd_net [get_bd_pins div16_0/clk_div] [get_bd_pins serial_shift_0/clk] [get_bd_pins proc_sys_reset_1M/slowest_sync_clk] [get_bd_pins s2p_0/clk]
connect_bd_net [get_bd_pins data_in] \
  [get_bd_pins serial_shift_0/data_in] [get_bd_pins D_flip_flops_4_0/D1] [get_bd_pins Counter_4bit_0/enp] \
  [get_bd_pins util_vector_logic_3/Op1]
connect_bd_net [get_bd_pins xlconstant_0/dout] [get_bd_pins Counter_4bit_0/value]
connect_bd_net [get_bd_pins D_flip_flops_4_0/Q3B] [get_bd_pins Counter_4bit_0/ent]
connect_bd_net [get_bd_pins D_flip_flops_4_0/Q1B] [get_bd_pins util_vector_logic_0/Op1]
connect_bd_net [get_bd_pins D_flip_flops_4_0/Q2B] [get_bd_pins util_vector_logic_0/Op2]
connect_bd_net [get_bd_pins util_vector_logic_0/Res] [get_bd_pins util_vector_logic_1/Op1]
connect_bd_net [get_bd_pins util_vector_logic_1/Res] [get_bd_pins Counter_4bit_0/loadn]
connect_bd_net [get_bd_pins Counter_4bit_0/out3] [get_bd_pins D_flip_flops_4_0/D3]
connect_bd_net [get_bd_pins D_flip_flops_4_0/Q3] [get_bd_pins D_flip_flops_4_0/D4]
connect_bd_net [get_bd_pins D_flip_flops_4_0/Q1] [get_bd_pins D_flip_flops_4_0/D2]
connect_bd_net [get_bd_pins serial_shift_0/Q4] [get_bd_pins util_vector_logic_2/Op1]
connect_bd_net [get_bd_pins serial_shift_0/Q5] [get_bd_pins util_vector_logic_2/Op2]
connect_bd_net [get_bd_pins util_vector_logic_2/Res] [get_bd_pins util_vector_logic_3/Op2]
connect_bd_net [get_bd_pins util_vector_logic_3/Res] [get_bd_pins data_out] [get_bd_pins s2p_0/data_in]
connect_bd_net [get_bd_pins reset_n] \
  [get_bd_pins proc_sys_reset_16M/ext_reset_in] [get_bd_pins proc_sys_reset_1M/ext_reset_in] [get_bd_pins s2p_0/rstn_100M]
connect_bd_net [get_bd_pins proc_sys_reset_16M/peripheral_aresetn] [get_bd_pins div16_0/rstn]
connect_bd_net [get_bd_pins link] [get_bd_pins s2p_0/link]
connect_bd_net [get_bd_pins s2p_0/link_err] [get_bd_pins link_err]
connect_bd_net [get_bd_pins s2p_0/address] [get_bd_pins address]
connect_bd_net [get_bd_pins s2p_0/data_out] [get_bd_pins data_out1]

current_bd_instance /link17
connect_bd_net [get_bd_pins clk_100M] [get_bd_pins s2p_0/clk_100M]
connect_bd_net -net reset_n_1 [get_bd_pins proc_sys_reset_1M/peripheral_aresetn] \
  [get_bd_pins serial_shift_0/rstn] [get_bd_pins D_flip_flops_4_0/rstn] [get_bd_pins Counter_4bit_0/rstn] \
  [get_bd_pins s2p_0/rstn]
connect_bd_net -net clk_wiz_0_clk_out1 [get_bd_pins clk_16M] \
  [get_bd_pins div16_0/clk] [get_bd_pins Counter_4bit_0/clk] [get_bd_pins D_flip_flops_4_0/clk] \
  [get_bd_pins proc_sys_reset_16M/slowest_sync_clk]
connect_bd_net [get_bd_pins div16_0/clk_div] [get_bd_pins serial_shift_0/clk] [get_bd_pins proc_sys_reset_1M/slowest_sync_clk] [get_bd_pins s2p_0/clk]
connect_bd_net [get_bd_pins data_in] \
  [get_bd_pins serial_shift_0/data_in] [get_bd_pins D_flip_flops_4_0/D1] [get_bd_pins Counter_4bit_0/enp] \
  [get_bd_pins util_vector_logic_3/Op1]
connect_bd_net [get_bd_pins xlconstant_0/dout] [get_bd_pins Counter_4bit_0/value]
connect_bd_net [get_bd_pins D_flip_flops_4_0/Q3B] [get_bd_pins Counter_4bit_0/ent]
connect_bd_net [get_bd_pins D_flip_flops_4_0/Q1B] [get_bd_pins util_vector_logic_0/Op1]
connect_bd_net [get_bd_pins D_flip_flops_4_0/Q2B] [get_bd_pins util_vector_logic_0/Op2]
connect_bd_net [get_bd_pins util_vector_logic_0/Res] [get_bd_pins util_vector_logic_1/Op1]
connect_bd_net [get_bd_pins util_vector_logic_1/Res] [get_bd_pins Counter_4bit_0/loadn]
connect_bd_net [get_bd_pins Counter_4bit_0/out3] [get_bd_pins D_flip_flops_4_0/D3]
connect_bd_net [get_bd_pins D_flip_flops_4_0/Q3] [get_bd_pins D_flip_flops_4_0/D4]
connect_bd_net [get_bd_pins D_flip_flops_4_0/Q1] [get_bd_pins D_flip_flops_4_0/D2]
connect_bd_net [get_bd_pins serial_shift_0/Q4] [get_bd_pins util_vector_logic_2/Op1]
connect_bd_net [get_bd_pins serial_shift_0/Q5] [get_bd_pins util_vector_logic_2/Op2]
connect_bd_net [get_bd_pins util_vector_logic_2/Res] [get_bd_pins util_vector_logic_3/Op2]
connect_bd_net [get_bd_pins util_vector_logic_3/Res] [get_bd_pins data_out] [get_bd_pins s2p_0/data_in]
connect_bd_net [get_bd_pins reset_n] \
  [get_bd_pins proc_sys_reset_16M/ext_reset_in] [get_bd_pins proc_sys_reset_1M/ext_reset_in] [get_bd_pins s2p_0/rstn_100M]
connect_bd_net [get_bd_pins proc_sys_reset_16M/peripheral_aresetn] [get_bd_pins div16_0/rstn]
connect_bd_net [get_bd_pins link] [get_bd_pins s2p_0/link]
connect_bd_net [get_bd_pins s2p_0/link_err] [get_bd_pins link_err]
connect_bd_net [get_bd_pins s2p_0/address] [get_bd_pins address]
connect_bd_net [get_bd_pins s2p_0/data_out] [get_bd_pins data_out1]

current_bd_instance /link18
connect_bd_net [get_bd_pins clk_100M] [get_bd_pins s2p_0/clk_100M]
connect_bd_net -net reset_n_1 [get_bd_pins proc_sys_reset_1M/peripheral_aresetn] \
  [get_bd_pins serial_shift_0/rstn] [get_bd_pins D_flip_flops_4_0/rstn] [get_bd_pins Counter_4bit_0/rstn] \
  [get_bd_pins s2p_0/rstn]
connect_bd_net -net clk_wiz_0_clk_out1 [get_bd_pins clk_16M] \
  [get_bd_pins div16_0/clk] [get_bd_pins Counter_4bit_0/clk] [get_bd_pins D_flip_flops_4_0/clk] \
  [get_bd_pins proc_sys_reset_16M/slowest_sync_clk]
connect_bd_net [get_bd_pins div16_0/clk_div] [get_bd_pins serial_shift_0/clk] [get_bd_pins proc_sys_reset_1M/slowest_sync_clk] [get_bd_pins s2p_0/clk]
connect_bd_net [get_bd_pins data_in] \
  [get_bd_pins serial_shift_0/data_in] [get_bd_pins D_flip_flops_4_0/D1] [get_bd_pins Counter_4bit_0/enp] \
  [get_bd_pins util_vector_logic_3/Op1]
connect_bd_net [get_bd_pins xlconstant_0/dout] [get_bd_pins Counter_4bit_0/value]
connect_bd_net [get_bd_pins D_flip_flops_4_0/Q3B] [get_bd_pins Counter_4bit_0/ent]
connect_bd_net [get_bd_pins D_flip_flops_4_0/Q1B] [get_bd_pins util_vector_logic_0/Op1]
connect_bd_net [get_bd_pins D_flip_flops_4_0/Q2B] [get_bd_pins util_vector_logic_0/Op2]
connect_bd_net [get_bd_pins util_vector_logic_0/Res] [get_bd_pins util_vector_logic_1/Op1]
connect_bd_net [get_bd_pins util_vector_logic_1/Res] [get_bd_pins Counter_4bit_0/loadn]
connect_bd_net [get_bd_pins Counter_4bit_0/out3] [get_bd_pins D_flip_flops_4_0/D3]
connect_bd_net [get_bd_pins D_flip_flops_4_0/Q3] [get_bd_pins D_flip_flops_4_0/D4]
connect_bd_net [get_bd_pins D_flip_flops_4_0/Q1] [get_bd_pins D_flip_flops_4_0/D2]
connect_bd_net [get_bd_pins serial_shift_0/Q4] [get_bd_pins util_vector_logic_2/Op1]
connect_bd_net [get_bd_pins serial_shift_0/Q5] [get_bd_pins util_vector_logic_2/Op2]
connect_bd_net [get_bd_pins util_vector_logic_2/Res] [get_bd_pins util_vector_logic_3/Op2]
connect_bd_net [get_bd_pins util_vector_logic_3/Res] [get_bd_pins data_out] [get_bd_pins s2p_0/data_in]
connect_bd_net [get_bd_pins reset_n] \
  [get_bd_pins proc_sys_reset_16M/ext_reset_in] [get_bd_pins proc_sys_reset_1M/ext_reset_in] [get_bd_pins s2p_0/rstn_100M]
connect_bd_net [get_bd_pins proc_sys_reset_16M/peripheral_aresetn] [get_bd_pins div16_0/rstn]
connect_bd_net [get_bd_pins link] [get_bd_pins s2p_0/link]
connect_bd_net [get_bd_pins s2p_0/link_err] [get_bd_pins link_err]
connect_bd_net [get_bd_pins s2p_0/address] [get_bd_pins address]
connect_bd_net [get_bd_pins s2p_0/data_out] [get_bd_pins data_out1]

current_bd_instance /link19
connect_bd_net [get_bd_pins clk_100M] [get_bd_pins s2p_0/clk_100M]
connect_bd_net -net reset_n_1 [get_bd_pins proc_sys_reset_1M/peripheral_aresetn] \
  [get_bd_pins serial_shift_0/rstn] [get_bd_pins D_flip_flops_4_0/rstn] [get_bd_pins Counter_4bit_0/rstn] \
  [get_bd_pins s2p_0/rstn]
connect_bd_net -net clk_wiz_0_clk_out1 [get_bd_pins clk_16M] \
  [get_bd_pins div16_0/clk] [get_bd_pins Counter_4bit_0/clk] [get_bd_pins D_flip_flops_4_0/clk] \
  [get_bd_pins proc_sys_reset_16M/slowest_sync_clk]
connect_bd_net [get_bd_pins div16_0/clk_div] [get_bd_pins serial_shift_0/clk] [get_bd_pins proc_sys_reset_1M/slowest_sync_clk] [get_bd_pins s2p_0/clk]
connect_bd_net [get_bd_pins data_in] \
  [get_bd_pins serial_shift_0/data_in] [get_bd_pins D_flip_flops_4_0/D1] [get_bd_pins Counter_4bit_0/enp] \
  [get_bd_pins util_vector_logic_3/Op1]
connect_bd_net [get_bd_pins xlconstant_0/dout] [get_bd_pins Counter_4bit_0/value]
connect_bd_net [get_bd_pins D_flip_flops_4_0/Q3B] [get_bd_pins Counter_4bit_0/ent]
connect_bd_net [get_bd_pins D_flip_flops_4_0/Q1B] [get_bd_pins util_vector_logic_0/Op1]
connect_bd_net [get_bd_pins D_flip_flops_4_0/Q2B] [get_bd_pins util_vector_logic_0/Op2]
connect_bd_net [get_bd_pins util_vector_logic_0/Res] [get_bd_pins util_vector_logic_1/Op1]
connect_bd_net [get_bd_pins util_vector_logic_1/Res] [get_bd_pins Counter_4bit_0/loadn]
connect_bd_net [get_bd_pins Counter_4bit_0/out3] [get_bd_pins D_flip_flops_4_0/D3]
connect_bd_net [get_bd_pins D_flip_flops_4_0/Q3] [get_bd_pins D_flip_flops_4_0/D4]
connect_bd_net [get_bd_pins D_flip_flops_4_0/Q1] [get_bd_pins D_flip_flops_4_0/D2]
connect_bd_net [get_bd_pins serial_shift_0/Q4] [get_bd_pins util_vector_logic_2/Op1]
connect_bd_net [get_bd_pins serial_shift_0/Q5] [get_bd_pins util_vector_logic_2/Op2]
connect_bd_net [get_bd_pins util_vector_logic_2/Res] [get_bd_pins util_vector_logic_3/Op2]
connect_bd_net [get_bd_pins util_vector_logic_3/Res] [get_bd_pins data_out] [get_bd_pins s2p_0/data_in]
connect_bd_net [get_bd_pins reset_n] \
  [get_bd_pins proc_sys_reset_16M/ext_reset_in] [get_bd_pins proc_sys_reset_1M/ext_reset_in] [get_bd_pins s2p_0/rstn_100M]
connect_bd_net [get_bd_pins proc_sys_reset_16M/peripheral_aresetn] [get_bd_pins div16_0/rstn]
connect_bd_net [get_bd_pins link] [get_bd_pins s2p_0/link]
connect_bd_net [get_bd_pins s2p_0/link_err] [get_bd_pins link_err]
connect_bd_net [get_bd_pins s2p_0/address] [get_bd_pins address]
connect_bd_net [get_bd_pins s2p_0/data_out] [get_bd_pins data_out1]
